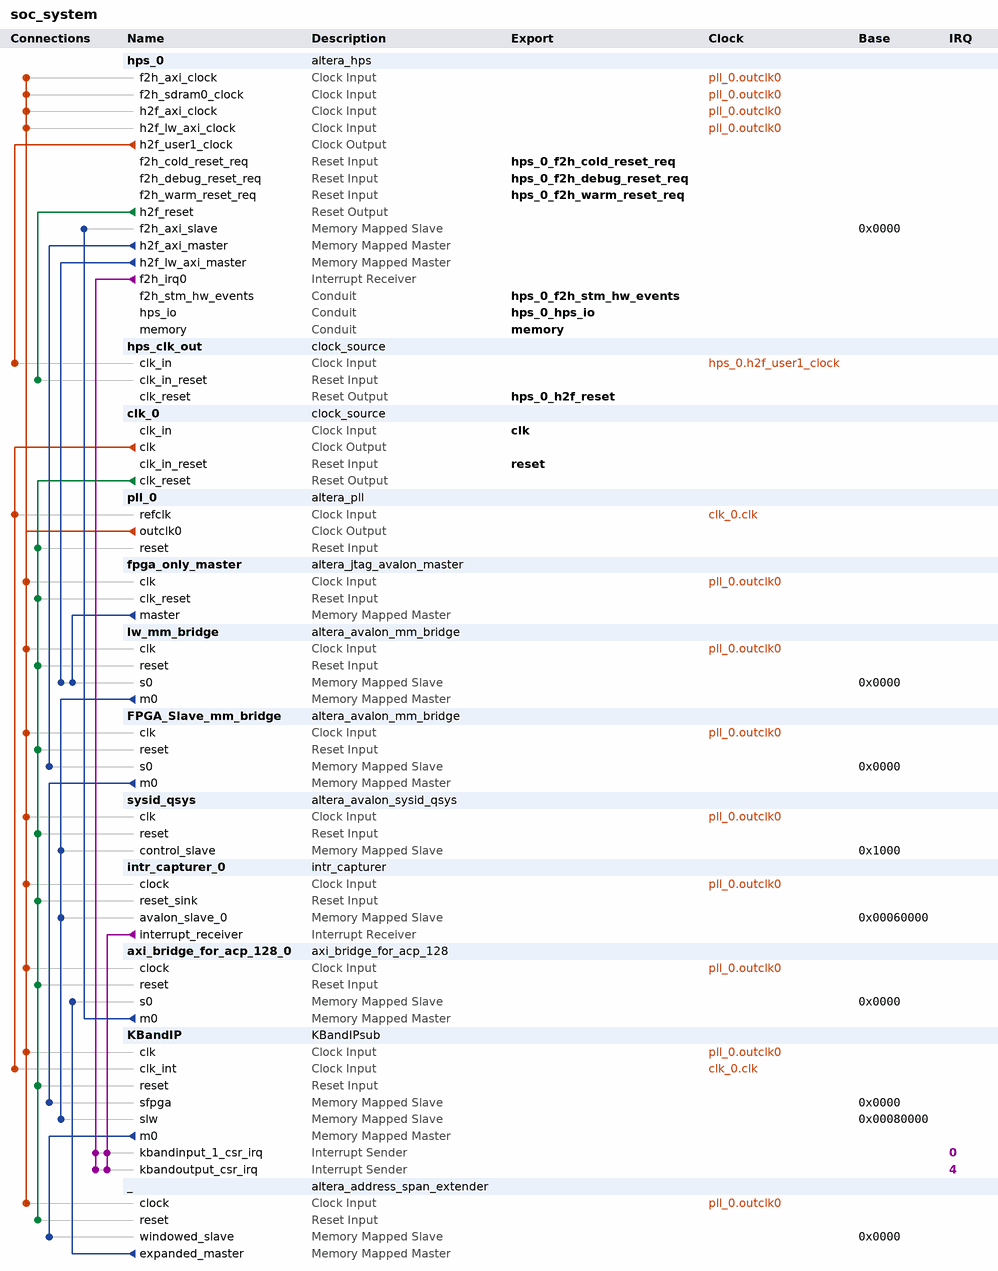
[diagram p0: system contents]
# Platform Designer (Qsys) system soc_system, Cyclone V 5CSEMA5F31C6
# Parameters at their usual value, and those the tool derives, are not listed.
package require -exact qsys 16.1
create_system soc_system
set_project_property DEVICE_FAMILY {Cyclone V}
set_project_property DEVICE 5CSEMA5F31C6

add_instance hps_0 altera_hps 16.1
set_instance_parameter_value hps_0 EMAC1_Mode RGMII
set_instance_parameter_value hps_0 EMAC1_PinMuxing {HPS I/O Set 0}
set_instance_parameter_value hps_0 F2SCLK_COLDRST_Enable true
set_instance_parameter_value hps_0 F2SCLK_DBGRST_Enable true
set_instance_parameter_value hps_0 F2SCLK_WARMRST_Enable true
set_instance_parameter_value hps_0 F2SDRAM_Type {Avalon-MM Bidirectional}
set_instance_parameter_value hps_0 F2SDRAM_Width 256
set_instance_parameter_value hps_0 F2SINTERRUPT_Enable true
set_instance_parameter_value hps_0 F2S_Width 3
set_instance_parameter_value hps_0 FPGA_PERIPHERAL_OUTPUT_CLOCK_FREQ_EMAC0_GTX_CLK 100
set_instance_parameter_value hps_0 FPGA_PERIPHERAL_OUTPUT_CLOCK_FREQ_EMAC0_MD_CLK 100.0
set_instance_parameter_value hps_0 FPGA_PERIPHERAL_OUTPUT_CLOCK_FREQ_EMAC1_GTX_CLK 100
set_instance_parameter_value hps_0 FPGA_PERIPHERAL_OUTPUT_CLOCK_FREQ_EMAC1_MD_CLK 100.0
set_instance_parameter_value hps_0 HPS_PROTOCOL DDR3
set_instance_parameter_value hps_0 I2C0_Mode I2C
set_instance_parameter_value hps_0 I2C0_PinMuxing {HPS I/O Set 0}
set_instance_parameter_value hps_0 I2C1_Mode I2C
set_instance_parameter_value hps_0 I2C1_PinMuxing {HPS I/O Set 0}
set_instance_parameter_value hps_0 LWH2F_Enable true
set_instance_parameter_value hps_0 MEM_BANKADDR_WIDTH 3
set_instance_parameter_value hps_0 MEM_CLK_FREQ 400.0
set_instance_parameter_value hps_0 MEM_COL_ADDR_WIDTH 10
set_instance_parameter_value hps_0 MEM_DQ_WIDTH 32
set_instance_parameter_value hps_0 MEM_DRV_STR RZQ/7
set_instance_parameter_value hps_0 MEM_ROW_ADDR_WIDTH 15
set_instance_parameter_value hps_0 MEM_RTT_NOM RZQ/4
set_instance_parameter_value hps_0 MEM_RTT_WR RZQ/4
set_instance_parameter_value hps_0 MEM_TCL 11
set_instance_parameter_value hps_0 MEM_TFAW_NS 30.0
set_instance_parameter_value hps_0 MEM_TRAS_NS 35.0
set_instance_parameter_value hps_0 MEM_TRCD_NS 13.75
set_instance_parameter_value hps_0 MEM_TRFC_NS 260.0
set_instance_parameter_value hps_0 MEM_TRP_NS 13.75
set_instance_parameter_value hps_0 MEM_VENDOR JEDEC
set_instance_parameter_value hps_0 MEM_WTCL 8
set_instance_parameter_value hps_0 QSPI_Mode {1 SS}
set_instance_parameter_value hps_0 QSPI_PinMuxing {HPS I/O Set 0}
set_instance_parameter_value hps_0 REF_CLK_FREQ 25.0
set_instance_parameter_value hps_0 S2FCLK_USER0CLK_Enable true
set_instance_parameter_value hps_0 S2FCLK_USER1CLK_Enable true
set_instance_parameter_value hps_0 S2FCLK_USER1CLK_FREQ 50.0
set_instance_parameter_value hps_0 S2FCLK_USER2CLK 5
set_instance_parameter_value hps_0 S2F_Width 2
set_instance_parameter_value hps_0 SDIO_Mode {4-bit Data}
set_instance_parameter_value hps_0 SDIO_PinMuxing {HPS I/O Set 0}
set_instance_parameter_value hps_0 SPIM1_Mode {Single Slave Select}
set_instance_parameter_value hps_0 SPIM1_PinMuxing {HPS I/O Set 0}
set_instance_parameter_value hps_0 STM_Enable true
set_instance_parameter_value hps_0 TIMING_BOARD_AC_SKEW 0.03
set_instance_parameter_value hps_0 TIMING_BOARD_AC_TO_CK_SKEW 0.0
set_instance_parameter_value hps_0 TIMING_BOARD_DQ_TO_DQS_SKEW 0.0
set_instance_parameter_value hps_0 TIMING_BOARD_MAX_CK_DELAY 0.03
set_instance_parameter_value hps_0 TIMING_BOARD_MAX_DQS_DELAY 0.02
set_instance_parameter_value hps_0 TIMING_BOARD_SKEW_BETWEEN_DQS 0.08
set_instance_parameter_value hps_0 TIMING_BOARD_SKEW_CKDQS_DIMM_MAX 0.16
set_instance_parameter_value hps_0 TIMING_BOARD_SKEW_CKDQS_DIMM_MIN 0.09
set_instance_parameter_value hps_0 TIMING_BOARD_SKEW_WITHIN_DQS 0.01
set_instance_parameter_value hps_0 TIMING_TDH 65
set_instance_parameter_value hps_0 TIMING_TDQSCK 255
set_instance_parameter_value hps_0 TIMING_TDQSQ 125
set_instance_parameter_value hps_0 TIMING_TDS 30
set_instance_parameter_value hps_0 TIMING_TIH 140
set_instance_parameter_value hps_0 TIMING_TIS 180
set_instance_parameter_value hps_0 TIMING_TQSH 0.4
set_instance_parameter_value hps_0 UART0_Mode {No Flow Control}
set_instance_parameter_value hps_0 UART0_PinMuxing {HPS I/O Set 0}
set_instance_parameter_value hps_0 USB1_Mode SDR
set_instance_parameter_value hps_0 USB1_PinMuxing {HPS I/O Set 0}
set_instance_parameter_value hps_0 desired_cfg_clk_mhz 100.0
set_instance_parameter_value hps_0 desired_qspi_clk_mhz 370.0

add_instance hps_clk_out clock_source 16.1
set_instance_parameter_value hps_clk_out clockFrequency 50000000

add_instance clk_0 clock_source 16.1
set_instance_parameter_value clk_0 clockFrequency 50000000

add_instance pll_0 altera_pll 16.1
set_instance_parameter_value pll_0 gui_device_speed_grade 1
set_instance_parameter_value pll_0 gui_number_of_clocks 1
set_instance_parameter_value pll_0 gui_operation_mode direct
set_instance_parameter_value pll_0 gui_output_clock_frequency0 200.0
set_instance_parameter_value pll_0 gui_pll_mode {Integer-N PLL}
set_instance_parameter_value pll_0 gui_reference_clock_frequency 50.0
set_instance_parameter_value pll_0 gui_use_locked false

add_instance fpga_only_master altera_jtag_avalon_master 16.1

add_instance lw_mm_bridge altera_avalon_mm_bridge 16.1
set_instance_parameter_value lw_mm_bridge ADDRESS_UNITS SYMBOLS
set_instance_parameter_value lw_mm_bridge ADDRESS_WIDTH 10
set_instance_parameter_value lw_mm_bridge DATA_WIDTH 32
set_instance_parameter_value lw_mm_bridge MAX_PENDING_RESPONSES 4
set_instance_parameter_value lw_mm_bridge USE_AUTO_ADDRESS_WIDTH 1

add_instance FPGA_Slave_mm_bridge altera_avalon_mm_bridge 16.1
set_instance_parameter_value FPGA_Slave_mm_bridge ADDRESS_UNITS SYMBOLS
set_instance_parameter_value FPGA_Slave_mm_bridge ADDRESS_WIDTH 10
set_instance_parameter_value FPGA_Slave_mm_bridge DATA_WIDTH 64
set_instance_parameter_value FPGA_Slave_mm_bridge MAX_PENDING_RESPONSES 4
set_instance_parameter_value FPGA_Slave_mm_bridge USE_AUTO_ADDRESS_WIDTH 1

add_instance sysid_qsys altera_avalon_sysid_qsys 16.1
set_instance_parameter_value sysid_qsys id -1395321854

add_instance intr_capturer_0 intr_capturer 1.0

add_instance axi_bridge_for_acp_128_0 axi_bridge_for_acp_128 1.0

add_instance KBandIP KBandIPsub 1.0

add_instance _ altera_address_span_extender 16.1
set_instance_parameter_value _ BURSTCOUNT_WIDTH 5
set_instance_parameter_value _ DATA_WIDTH 128
set_instance_parameter_value _ ENABLE_SLAVE_PORT true
set_instance_parameter_value _ MASTER_ADDRESS_DEF 2147483648
set_instance_parameter_value _ MAX_PENDING_READS 8
set_instance_parameter_value _ SLAVE_ADDRESS_WIDTH 26

# connections
add_connection clk_0.clk KBandIP.clk_int clock
add_connection clk_0.clk pll_0.refclk clock
add_connection hps_0.h2f_user1_clock hps_clk_out.clk_in clock
add_connection pll_0.outclk0 _.clock clock
add_connection pll_0.outclk0 axi_bridge_for_acp_128_0.clock clock
add_connection pll_0.outclk0 fpga_only_master.clk clock
add_connection pll_0.outclk0 FPGA_Slave_mm_bridge.clk clock
add_connection pll_0.outclk0 hps_0.f2h_axi_clock clock
add_connection pll_0.outclk0 hps_0.f2h_sdram0_clock clock
add_connection pll_0.outclk0 hps_0.h2f_axi_clock clock
add_connection pll_0.outclk0 hps_0.h2f_lw_axi_clock clock
add_connection pll_0.outclk0 intr_capturer_0.clock clock
add_connection pll_0.outclk0 KBandIP.clk clock
add_connection pll_0.outclk0 lw_mm_bridge.clk clock
add_connection pll_0.outclk0 sysid_qsys.clk clock
add_connection clk_0.clk_reset _.reset reset
add_connection clk_0.clk_reset axi_bridge_for_acp_128_0.reset reset
add_connection clk_0.clk_reset fpga_only_master.clk_reset reset
add_connection clk_0.clk_reset FPGA_Slave_mm_bridge.reset reset
add_connection clk_0.clk_reset intr_capturer_0.reset_sink reset
add_connection clk_0.clk_reset KBandIP.reset reset
add_connection clk_0.clk_reset lw_mm_bridge.reset reset
add_connection clk_0.clk_reset pll_0.reset reset
add_connection clk_0.clk_reset sysid_qsys.reset reset
add_connection hps_0.h2f_reset hps_clk_out.clk_in_reset reset
add_connection _.expanded_master axi_bridge_for_acp_128_0.s0 avalon
set_connection_parameter_value _.expanded_master/axi_bridge_for_acp_128_0.s0 baseAddress 0x0000
add_connection axi_bridge_for_acp_128_0.m0 hps_0.f2h_axi_slave avalon
set_connection_parameter_value axi_bridge_for_acp_128_0.m0/hps_0.f2h_axi_slave baseAddress 0x0000
add_connection fpga_only_master.master lw_mm_bridge.s0 avalon
set_connection_parameter_value fpga_only_master.master/lw_mm_bridge.s0 baseAddress 0x0000
add_connection FPGA_Slave_mm_bridge.m0 KBandIP.sfpga avalon
set_connection_parameter_value FPGA_Slave_mm_bridge.m0/KBandIP.sfpga baseAddress 0x0000
add_connection hps_0.h2f_axi_master FPGA_Slave_mm_bridge.s0 avalon
set_connection_parameter_value hps_0.h2f_axi_master/FPGA_Slave_mm_bridge.s0 baseAddress 0x0000
add_connection hps_0.h2f_lw_axi_master lw_mm_bridge.s0 avalon
set_connection_parameter_value hps_0.h2f_lw_axi_master/lw_mm_bridge.s0 baseAddress 0x0000
add_connection KBandIP.m0 _.windowed_slave avalon
set_connection_parameter_value KBandIP.m0/_.windowed_slave baseAddress 0x0000
add_connection lw_mm_bridge.m0 intr_capturer_0.avalon_slave_0 avalon
set_connection_parameter_value lw_mm_bridge.m0/intr_capturer_0.avalon_slave_0 baseAddress 0x00060000
add_connection lw_mm_bridge.m0 KBandIP.slw avalon
set_connection_parameter_value lw_mm_bridge.m0/KBandIP.slw baseAddress 0x00080000
add_connection lw_mm_bridge.m0 sysid_qsys.control_slave avalon
set_connection_parameter_value lw_mm_bridge.m0/sysid_qsys.control_slave baseAddress 0x1000
add_connection hps_0.f2h_irq0 KBandIP.kbandinput_1_csr_irq interrupt
set_connection_parameter_value hps_0.f2h_irq0/KBandIP.kbandinput_1_csr_irq irqNumber 0
add_connection hps_0.f2h_irq0 KBandIP.kbandoutput_csr_irq interrupt
set_connection_parameter_value hps_0.f2h_irq0/KBandIP.kbandoutput_csr_irq irqNumber 4
add_connection intr_capturer_0.interrupt_receiver KBandIP.kbandinput_1_csr_irq interrupt
set_connection_parameter_value intr_capturer_0.interrupt_receiver/KBandIP.kbandinput_1_csr_irq irqNumber 0
add_connection intr_capturer_0.interrupt_receiver KBandIP.kbandoutput_csr_irq interrupt
set_connection_parameter_value intr_capturer_0.interrupt_receiver/KBandIP.kbandoutput_csr_irq irqNumber 4

# exported interfaces
add_interface clk clock sink
set_interface_property clk EXPORT_OF clk_0.clk_in
add_interface hps_0_f2h_cold_reset_req reset sink
set_interface_property hps_0_f2h_cold_reset_req EXPORT_OF hps_0.f2h_cold_reset_req
add_interface hps_0_f2h_debug_reset_req reset sink
set_interface_property hps_0_f2h_debug_reset_req EXPORT_OF hps_0.f2h_debug_reset_req
add_interface hps_0_f2h_stm_hw_events conduit end
set_interface_property hps_0_f2h_stm_hw_events EXPORT_OF hps_0.f2h_stm_hw_events
add_interface hps_0_f2h_warm_reset_req reset sink
set_interface_property hps_0_f2h_warm_reset_req EXPORT_OF hps_0.f2h_warm_reset_req
add_interface hps_0_h2f_reset reset source
set_interface_property hps_0_h2f_reset EXPORT_OF hps_clk_out.clk_reset
add_interface hps_0_hps_io conduit end
set_interface_property hps_0_hps_io EXPORT_OF hps_0.hps_io
add_interface memory conduit end
set_interface_property memory EXPORT_OF hps_0.memory
add_interface reset reset sink
set_interface_property reset EXPORT_OF clk_0.clk_in_reset

set_interconnect_requirement {$system} qsys_mm.clockCrossingAdapter HANDSHAKE
set_interconnect_requirement {$system} qsys_mm.maxAdditionalLatency 1

save_system soc_system.qsys
